# Altium schematic sheet QCopterFC_MAIN_Sch.SchDoc
size A4
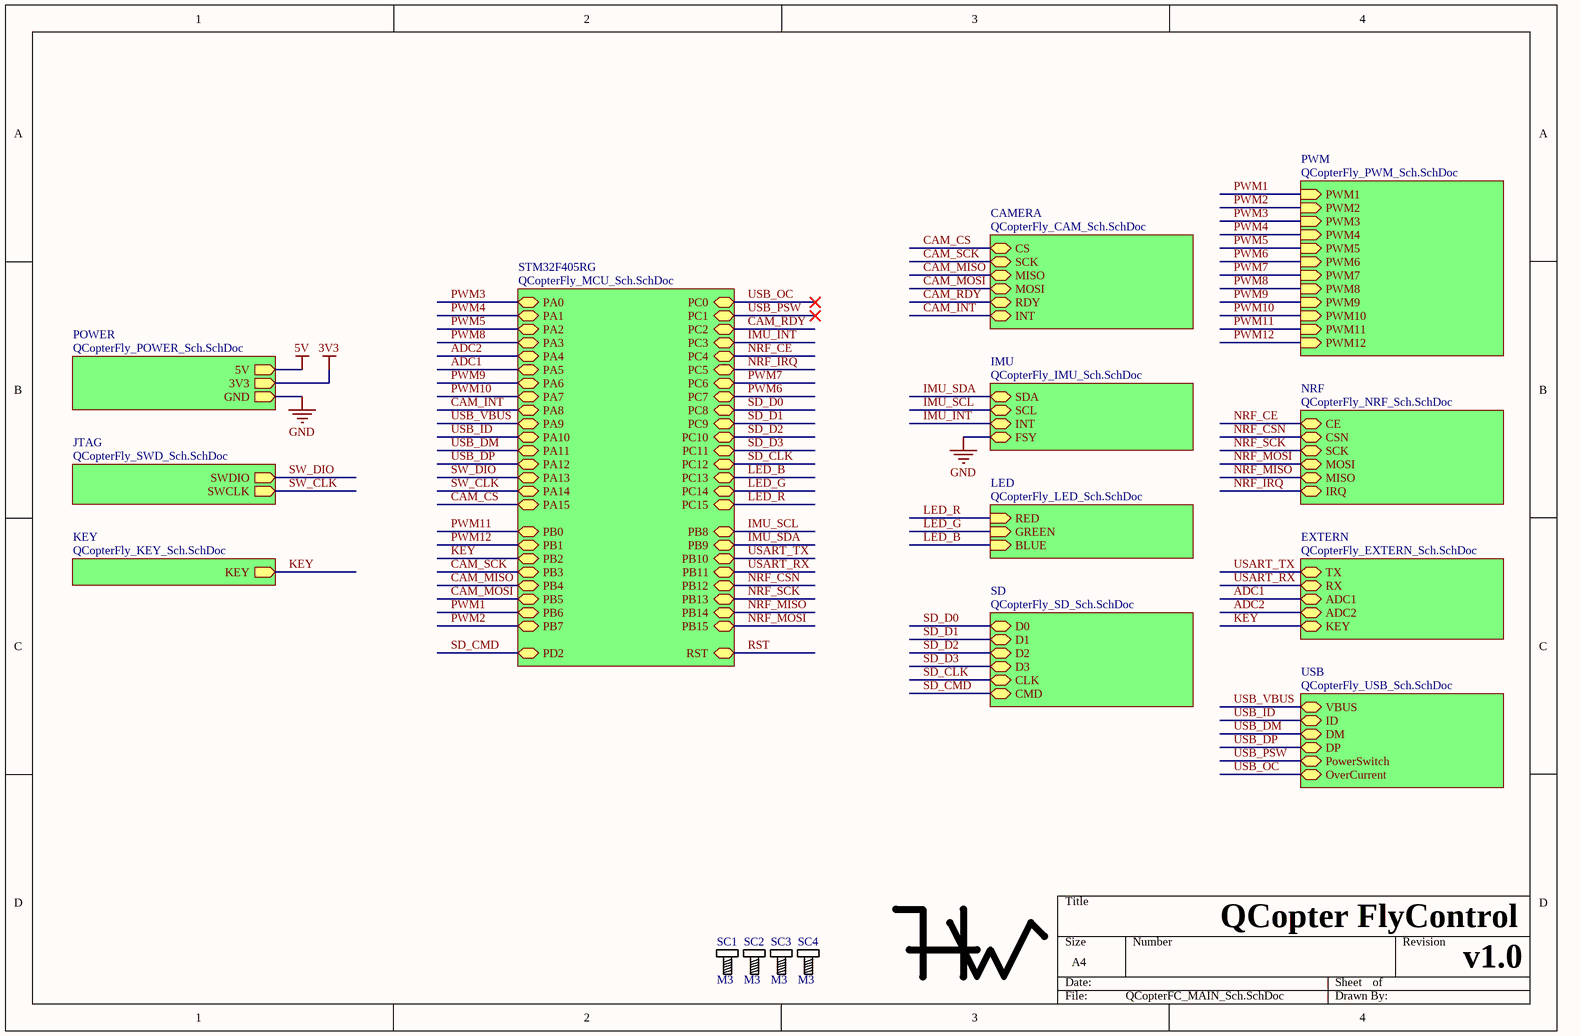
[diagram p0: QCopterFC_MAIN_Sch.SchDoc]

## Parts
Mark1  Mark  [HW_Mark]  (value not drawn)
SC1  M3  [SCRREW_M3]
SC2  M3  [SCRREW_M3]
SC3  M3  [SCRREW_M3]
SC4  M3  [SCRREW_M3]

## Sub-sheets
CAMERA = QCopterFly_CAM_Sch.SchDoc: MISO, CS, MOSI, SCK, RDY, INT
EXTERN = QCopterFly_EXTERN_Sch.SchDoc: ADC1, ADC2, TX, RX, KEY
IMU = QCopterFly_IMU_Sch.SchDoc: SCL, SDA, FSY, INT
JTAG = QCopterFly_SWD_Sch.SchDoc: SWDIO (out), SWCLK (out)
KEY = QCopterFly_KEY_Sch.SchDoc: KEY (out)
LED = QCopterFly_LED_Sch.SchDoc: RED (in), GREEN (in), BLUE (in)
NRF = QCopterFly_NRF_Sch.SchDoc: MISO, MOSI, SCK, CSN, CE, IRQ
POWER = QCopterFly_POWER_Sch.SchDoc: 3V3 (out), 5V (out), GND (out)
PWM = QCopterFly_PWM_Sch.SchDoc: PWM1 (in), PWM2 (in), PWM3 (in), PWM4 (in), PWM5 (in), PWM6 (in), PWM7 (in), PWM8 (in), PWM9 (in), PWM10 (in), PWM11 (in), PWM12 (in)
SD = QCopterFly_SD_Sch.SchDoc: D0, CLK, CMD, D1, D2, D3
STM32F405RG = QCopterFly_MCU_Sch.SchDoc: PA0, PA1, PA2, PA3, PA4, PA5, PA6, PA7, PA8, PA9, PA10, PA11, PA12, PA13, PA14, PA15, PB0, PB1, PB2, PB3, PB4, PB5, PB6, PB7, PB8, PB9, PB10, PB11, PB12, PB13, PB14, PB15, PC0, PC1, PC2, PC3, PC4, PC5, PC6, PC7, PC8, PC9, PC10, PC11, PC12, PC13, PC14, PC15, PD2, RST
USB = QCopterFly_USB_Sch.SchDoc: VBUS, ID, DM, DP, PowerSwitch, OverCurrent

## Nets
3V3: sheet POWER/3V3
5V: sheet POWER/5V
GND: sheet IMU/FSY, sheet POWER/GND
ADC1: sheet STM32F405RG/PA5, sheet EXTERN/ADC1
ADC2: sheet STM32F405RG/PA4, sheet EXTERN/ADC2
CAM_CS: sheet CAMERA/CS, sheet STM32F405RG/PA15
CAM_INT: sheet CAMERA/INT, sheet STM32F405RG/PA8
CAM_MISO: sheet CAMERA/MISO, sheet STM32F405RG/PB4
CAM_MOSI: sheet CAMERA/MOSI, sheet STM32F405RG/PB5
CAM_RDY: sheet CAMERA/RDY, sheet STM32F405RG/PC2
CAM_SCK: sheet CAMERA/SCK, sheet STM32F405RG/PB3
IMU_INT: sheet IMU/INT, sheet STM32F405RG/PC3
IMU_SCL: sheet IMU/SCL, sheet STM32F405RG/PB8
IMU_SDA: sheet IMU/SDA, sheet STM32F405RG/PB9
KEY: sheet KEY/KEY, sheet STM32F405RG/PB2, sheet EXTERN/KEY
LED_B: sheet LED/BLUE, sheet STM32F405RG/PC13
LED_G: sheet LED/GREEN, sheet STM32F405RG/PC14
LED_R: sheet LED/RED, sheet STM32F405RG/PC15
NRF_CE: sheet NRF/CE, sheet STM32F405RG/PC4
NRF_CSN: sheet NRF/CSN, sheet STM32F405RG/PB12
NRF_IRQ: sheet NRF/IRQ, sheet STM32F405RG/PC5
NRF_MISO: sheet NRF/MISO, sheet STM32F405RG/PB14
NRF_MOSI: sheet NRF/MOSI, sheet STM32F405RG/PB15
NRF_SCK: sheet NRF/SCK, sheet STM32F405RG/PB13
PWM1: sheet PWM/PWM1, sheet STM32F405RG/PB6
PWM2: sheet PWM/PWM2, sheet STM32F405RG/PB7
PWM3: sheet PWM/PWM3, sheet STM32F405RG/PA0
PWM4: sheet PWM/PWM4, sheet STM32F405RG/PA1
PWM5: sheet PWM/PWM5, sheet STM32F405RG/PA2
PWM6: sheet PWM/PWM6, sheet STM32F405RG/PC7
PWM7: sheet PWM/PWM7, sheet STM32F405RG/PC6
PWM8: sheet PWM/PWM8, sheet STM32F405RG/PA3
PWM9: sheet PWM/PWM9, sheet STM32F405RG/PA6
PWM10: sheet PWM/PWM10, sheet STM32F405RG/PA7
PWM11: sheet PWM/PWM11, sheet STM32F405RG/PB0
PWM12: sheet PWM/PWM12, sheet STM32F405RG/PB1
RST: sheet STM32F405RG/RST
SD_CLK: sheet STM32F405RG/PC12, sheet SD/CLK
SD_CMD: sheet STM32F405RG/PD2, sheet SD/CMD
SD_D0: sheet STM32F405RG/PC8, sheet SD/D0
SD_D1: sheet STM32F405RG/PC9, sheet SD/D1
SD_D2: sheet STM32F405RG/PC10, sheet SD/D2
SD_D3: sheet STM32F405RG/PC11, sheet SD/D3
SW_CLK: sheet JTAG/SWCLK, sheet STM32F405RG/PA14
SW_DIO: sheet JTAG/SWDIO, sheet STM32F405RG/PA13
USART_RX: sheet STM32F405RG/PB11, sheet EXTERN/RX
USART_TX: sheet STM32F405RG/PB10, sheet EXTERN/TX
USB_DM: sheet STM32F405RG/PA11, sheet USB/DM
USB_DP: sheet STM32F405RG/PA12, sheet USB/DP
USB_ID: sheet STM32F405RG/PA10, sheet USB/ID
USB_OC: sheet STM32F405RG/PC0, sheet USB/OverCurrent
USB_PSW: sheet STM32F405RG/PC1, sheet USB/PowerSwitch
USB_VBUS: sheet STM32F405RG/PA9, sheet USB/VBUS

## Notes on the sheet
- QCopter FlyControl
- v1.0

## Library data of the parts
Mark1 = HW
SC1-SC4 = Screw_M3: Screw